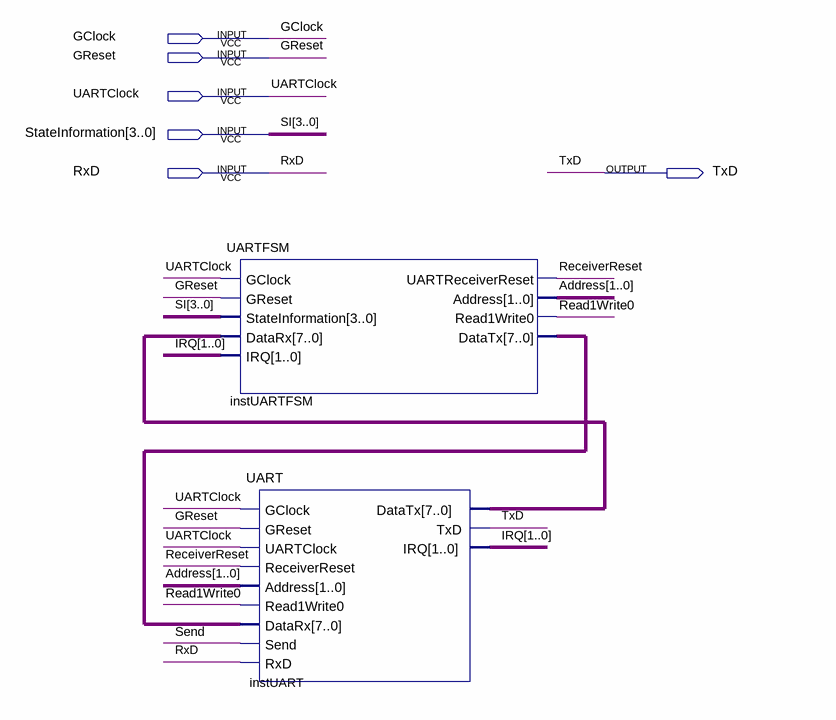
[diagram p0: schematic sheet]
// Quartus schematic UARTTop.bdf as structural Verilog: 2 symbols, 6 pins
module UARTTop (
  input  GClock,
  input  GReset,
  input  UARTClock,
  input  [3:0] StateInformation,
  input  RxD,
  output TxD
);

  wire Read1Write0, ReceiverReset, Send;
  wire [1:0] Address, IRQ;
  wire [7:0] instUART_datatx, instUARTFSM_datatx;

  UARTFSM instUARTFSM (
    .GClock(UARTClock), .GReset(GReset), .StateInformation(StateInformation), .DataRx(instUART_datatx),
    .IRQ(IRQ), .UARTReceiverReset(ReceiverReset), .Address(Address), .Read1Write0(Read1Write0),
    .DataTx(instUARTFSM_datatx));
  UART instUART (
    .GClock(UARTClock), .GReset(GReset), .UARTClock(UARTClock), .ReceiverReset(ReceiverReset),
    .Address(Address), .Read1Write0(Read1Write0), .DataRx(instUARTFSM_datatx), .Send(Send), .RxD(RxD),
    .DataTx(instUART_datatx), .TxD(TxD), .IRQ(IRQ));

  // Other names for the same wires on the sheet: SI[3:0] = StateInformation
endmodule
